# Altium schematic sheet PWR_PROT_AND_VI_SENSE.SchDoc
size A; SheetNumber: 11; SheetTotal: 12
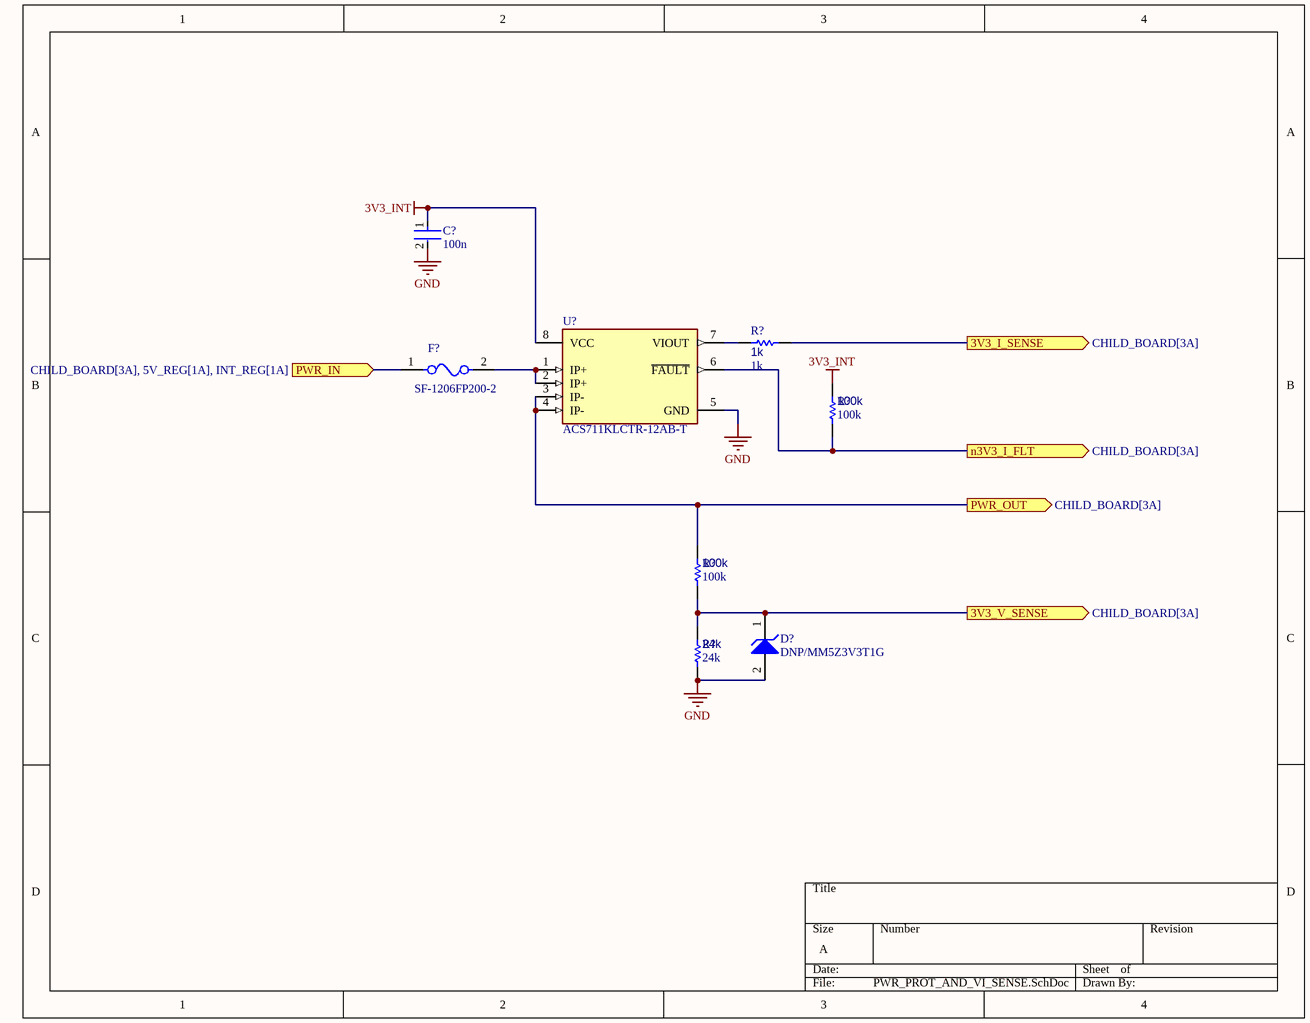
[diagram p0: PWR_PROT_AND_VI_SENSE.SchDoc]

## Parts
(Parts that share a designator on the sheet are numbered #1, #2 ... from top to bottom, then left to right.)
C?  100n  [FP-0402-L_1_0_0_05-W_0_5-IPC_A]
D?  DNP/MM5Z3V3T1G  [ONSC-SOD-523-2-502-01_V]
F?  SF-1206FP200-2  [FP-SF-1206FP-MFG]
R?#1  1k  [R0603B]
R?#2  100k  [R0603B]
R?#3  100k  [R0603B]
R?#4  24k  [R0603B]
U?  ACS711KLCTR-12AB-T  [FP-LC-8-IPC_C]

## Ports
3V3_I_SENSE (out, see CHILD_BOARD[3A]), 3V3_V_SENSE (out, see CHILD_BOARD[3A]), n3V3_I_FLT (out, see CHILD_BOARD[3A]), PWR_IN (in, see CHILD_BOARD[3A], 5V_REG[1A], INT_REG[1A]), PWR_OUT (out, see CHILD_BOARD[3A])

## Nets
3V3_INT: C?.1 R?#2.2 U?.8(VCC)
GND: C?.2 D?.2(A) R?#4.1 U?.5(GND)
3V3_I_SENSE: R?#1.2 ; port 3V3_I_SENSE
3V3_V_SENSE: D?.1(K) R?#3.1 R?#4.2 ; port 3V3_V_SENSE
n3V3_I_FLT: R?#2.1 U?.6(~{FAULT}) ; port n3V3_I_FLT
PWR_IN: F?.1 ; port PWR_IN
PWR_OUT: R?#3.2 U?.3(IP-) U?.4(IP-) ; port PWR_OUT
NetF?_2: F?.2 U?.1(IP+) U?.2(IP+)
NetR?#1_1: R?#1.1 U?.7(VIOUT)

## Library data of the parts
C? = CMP-001-00058-1: LARGE PADS, 0402 CAP, CHANGE COMMENT TO MATCH REAL P/N; Capacitor Type: Ceramic; Min Operating Temperature: -55°C; Mounting Technology: Surface Mount; Pins: 2; Case/Package: 0402; RoHS Compliant: Yes; Max Operating Temperature: 85°C
D? = CMP-1060-00750-1: Zener Voltage Regulator, 500 mW, 2-Pin SOD-523, Pb-Free, Tape and Reel; Manufacturer: On Semiconductor; P Max (W): 0.5; VZ Typ (V): 3.3; RoHS: Pb-Free; ComponentLink2Description: Datasheet; PackageReference: SOD-523-2-502-01; DatasheetVersion: Rev. 10; ComponentLink1Description: Manufacturer URL; PackageVersion: Rev. E, 09/2010; ComponentLink3URL: http://www.onsemi.com/pub_link/Collateral/502-01.PDF; ComponentLink2URL: http://www.onsemi.cn/pub_link/Collateral/MM5Z2V4T1-D.PDF; Mounting Technology: Surface Mount; PartNumber: MM5Z3V3T1G; Packing: Tape and Reel; PackageDescription: 2-Pin SOD, Body 1.2 x 0.8 mm; ComponentLink1URL: http://www.onsemi.com/; ComponentLink3Description: Package Specification
F? = CMP-07399-000013-1: FUSE BOARD MOUNT 2A 63VDC 1206; Voltage Rating (DC): 63V; Fuse Type: Board Mount (Cartridge Style Excluded); Approvals: UL; Mount: Surface Mount; Min Operating Temperature: -20°C; Max Operating Temperature: 105°C; Case Code (Imperial): 1206; Packaging: Cut Tape; Current Rating: 2A; RoHS Compliant: Yes; Series: SinglFuse™ SF-1206FP; Case Code (Metric): 3216; Case/Package: 1206
R?#1-R?#4 = CMP-009-00002-14: Resistor
  R?#1: Value: 1k
  R?#2 R?#3: Value: 100k
  R?#4: Value: 24k
U? = CMP-1557-00012-2: SENSOR CURRENT HALL 12.5A AC/DC; Number of Channels: 1; Min Supply Voltage: 3V; Sensitivity: 110mV/A; Response Time: 4.6us; Operating Supply Voltage: 3.3V; Max Supply Voltage: 5.5V; Max Supply Current: 5.5mA; Bandwidth: 100kHz; Linearity: 1%; Quiescent Current: 4mA; Accuracy: 5%; Polarity: Bidirectional; Case/Package: SOIC; Packaging: Tape and Reel; Number of Pins: 8; Width: 3.9mm; Frequency: 100kHz; -3db Bandwidth: 100kHz; REACH SVHC: No SVHC; Series: -; Height: 1.5mm; Package Quantity: 1; Min Operating Temperature: -40°C; Max Operating Temperature: 125°C; Current Sensing: 12.5A; RoHS Compliant: Yes; Length: 4.9mm